# EasyEDA Pro project ProPrj_PCB_PCB_PCB_PCB_STM32F103C8T6(gift)_2023-09-09_2023-10-22_2024-01-15_2025-05-13.epro, board PCB1
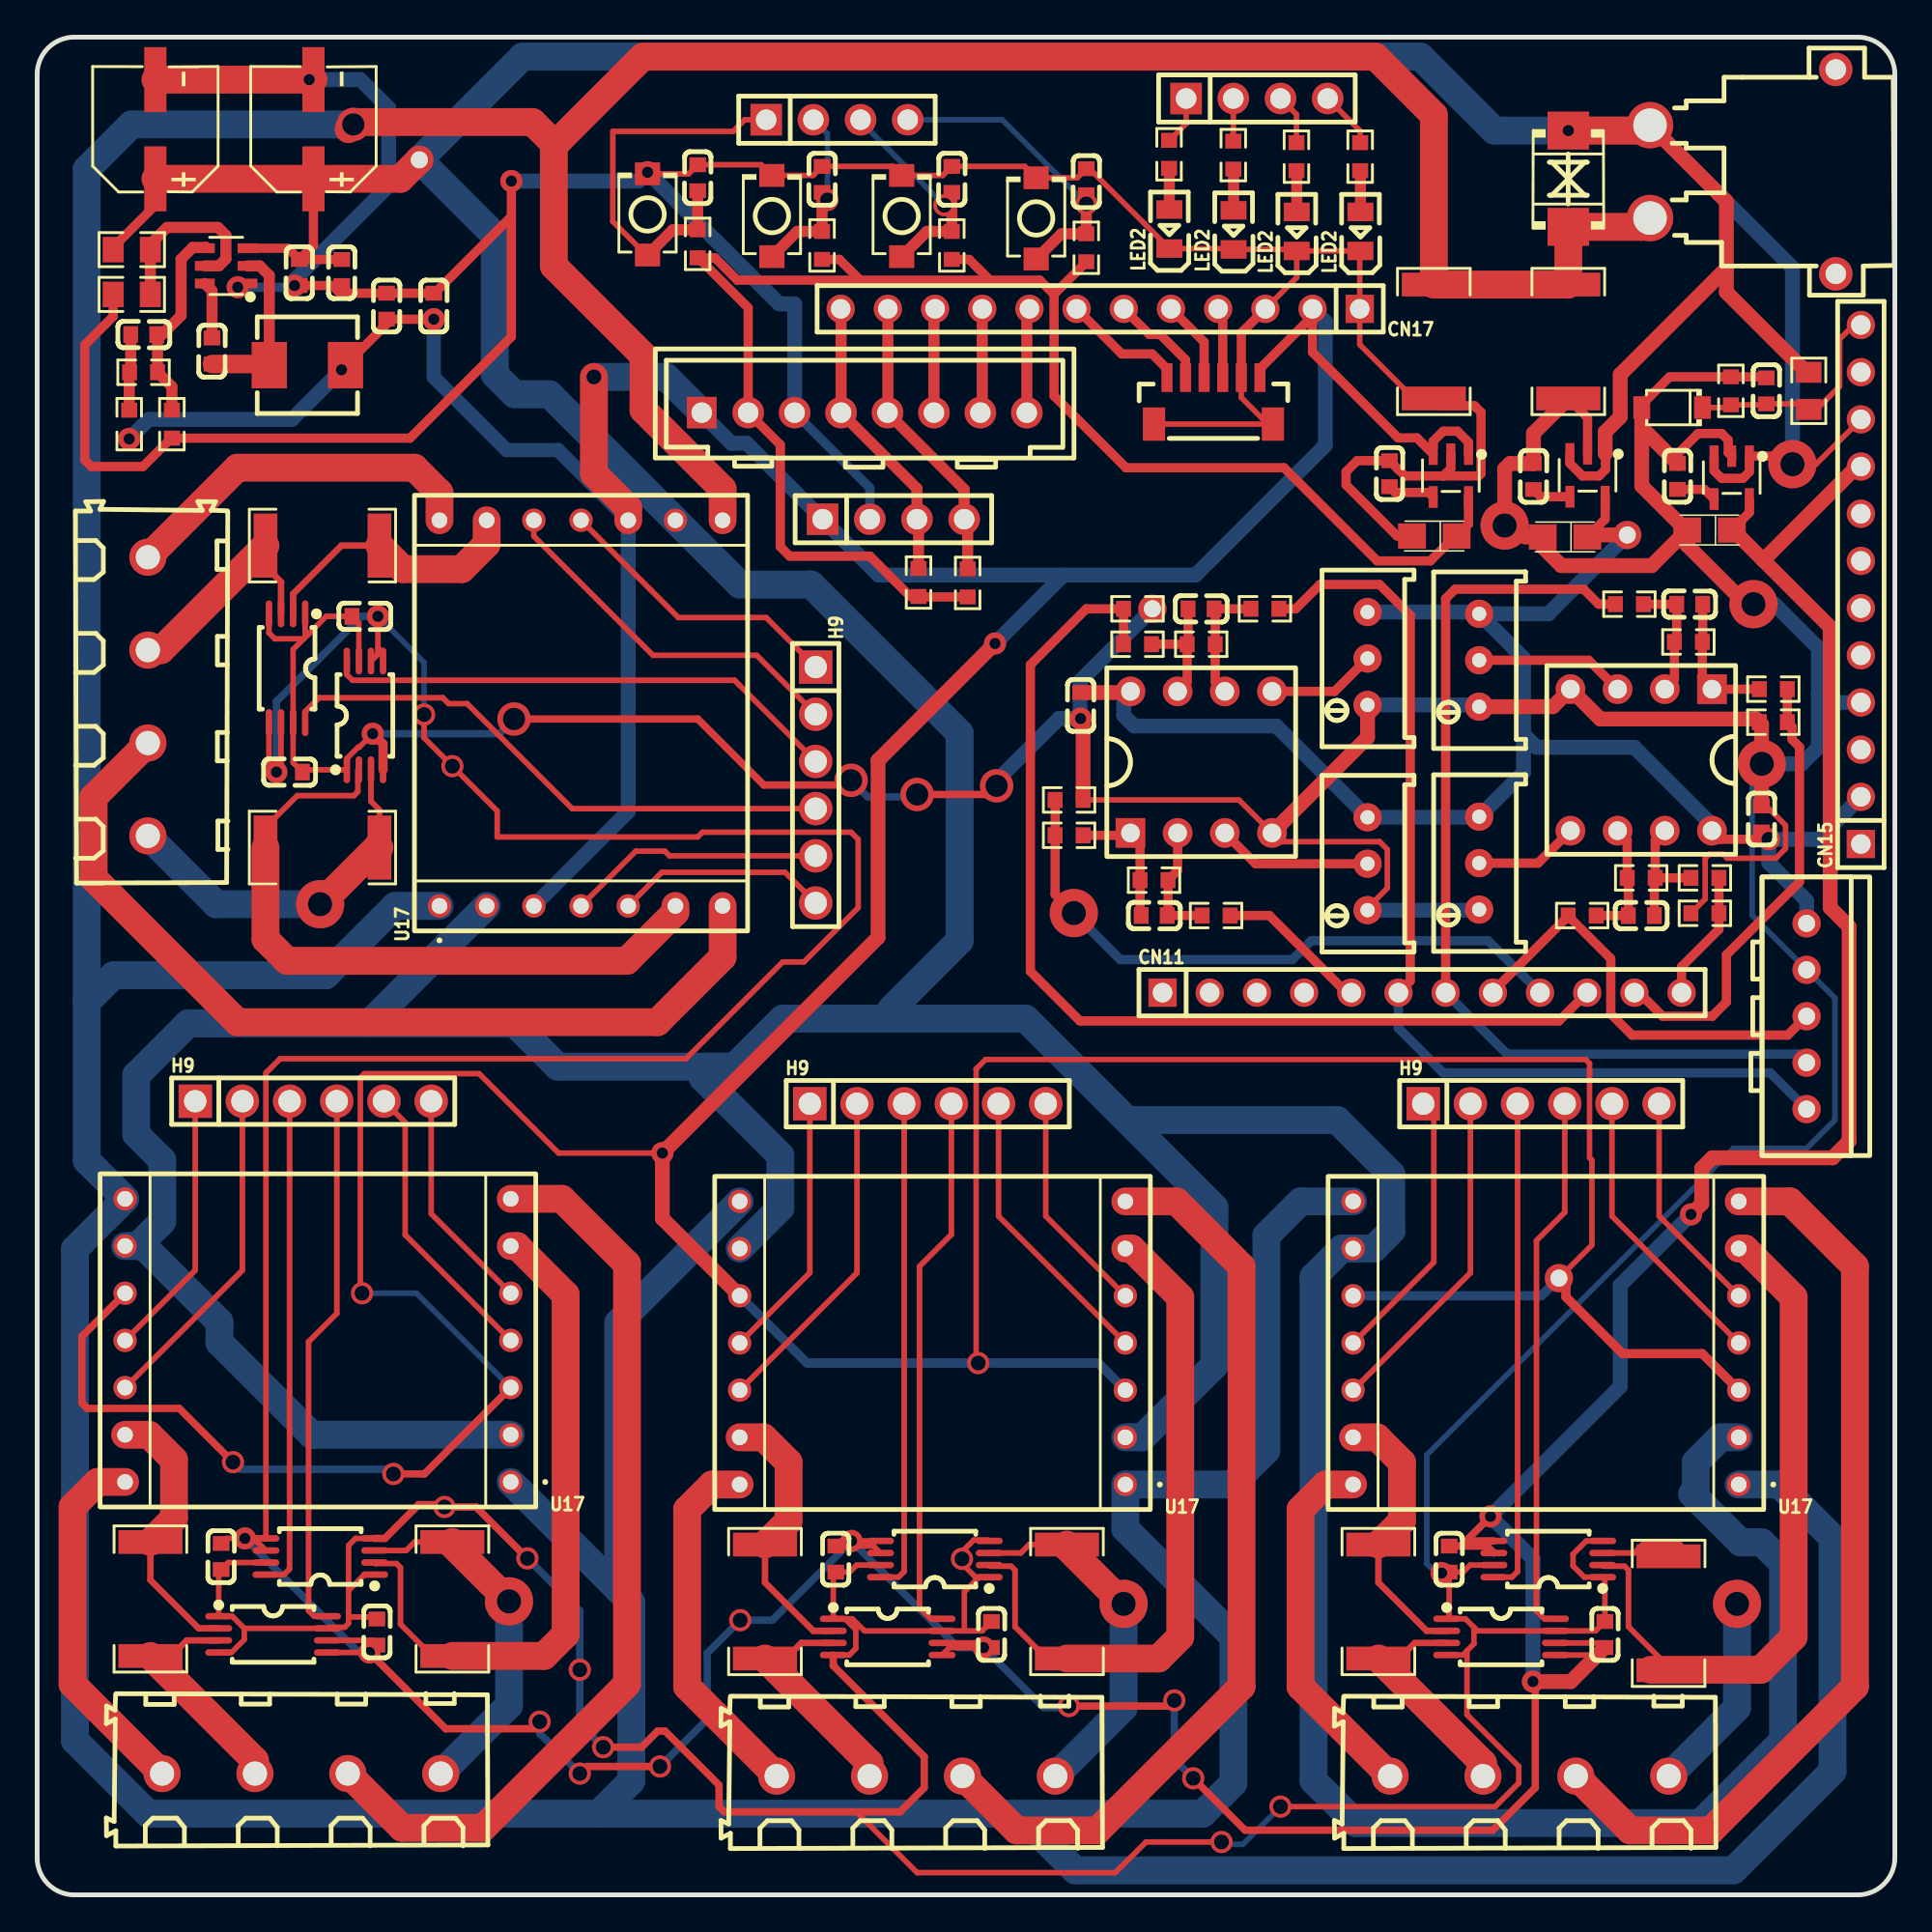
[diagram p10: board, top side]
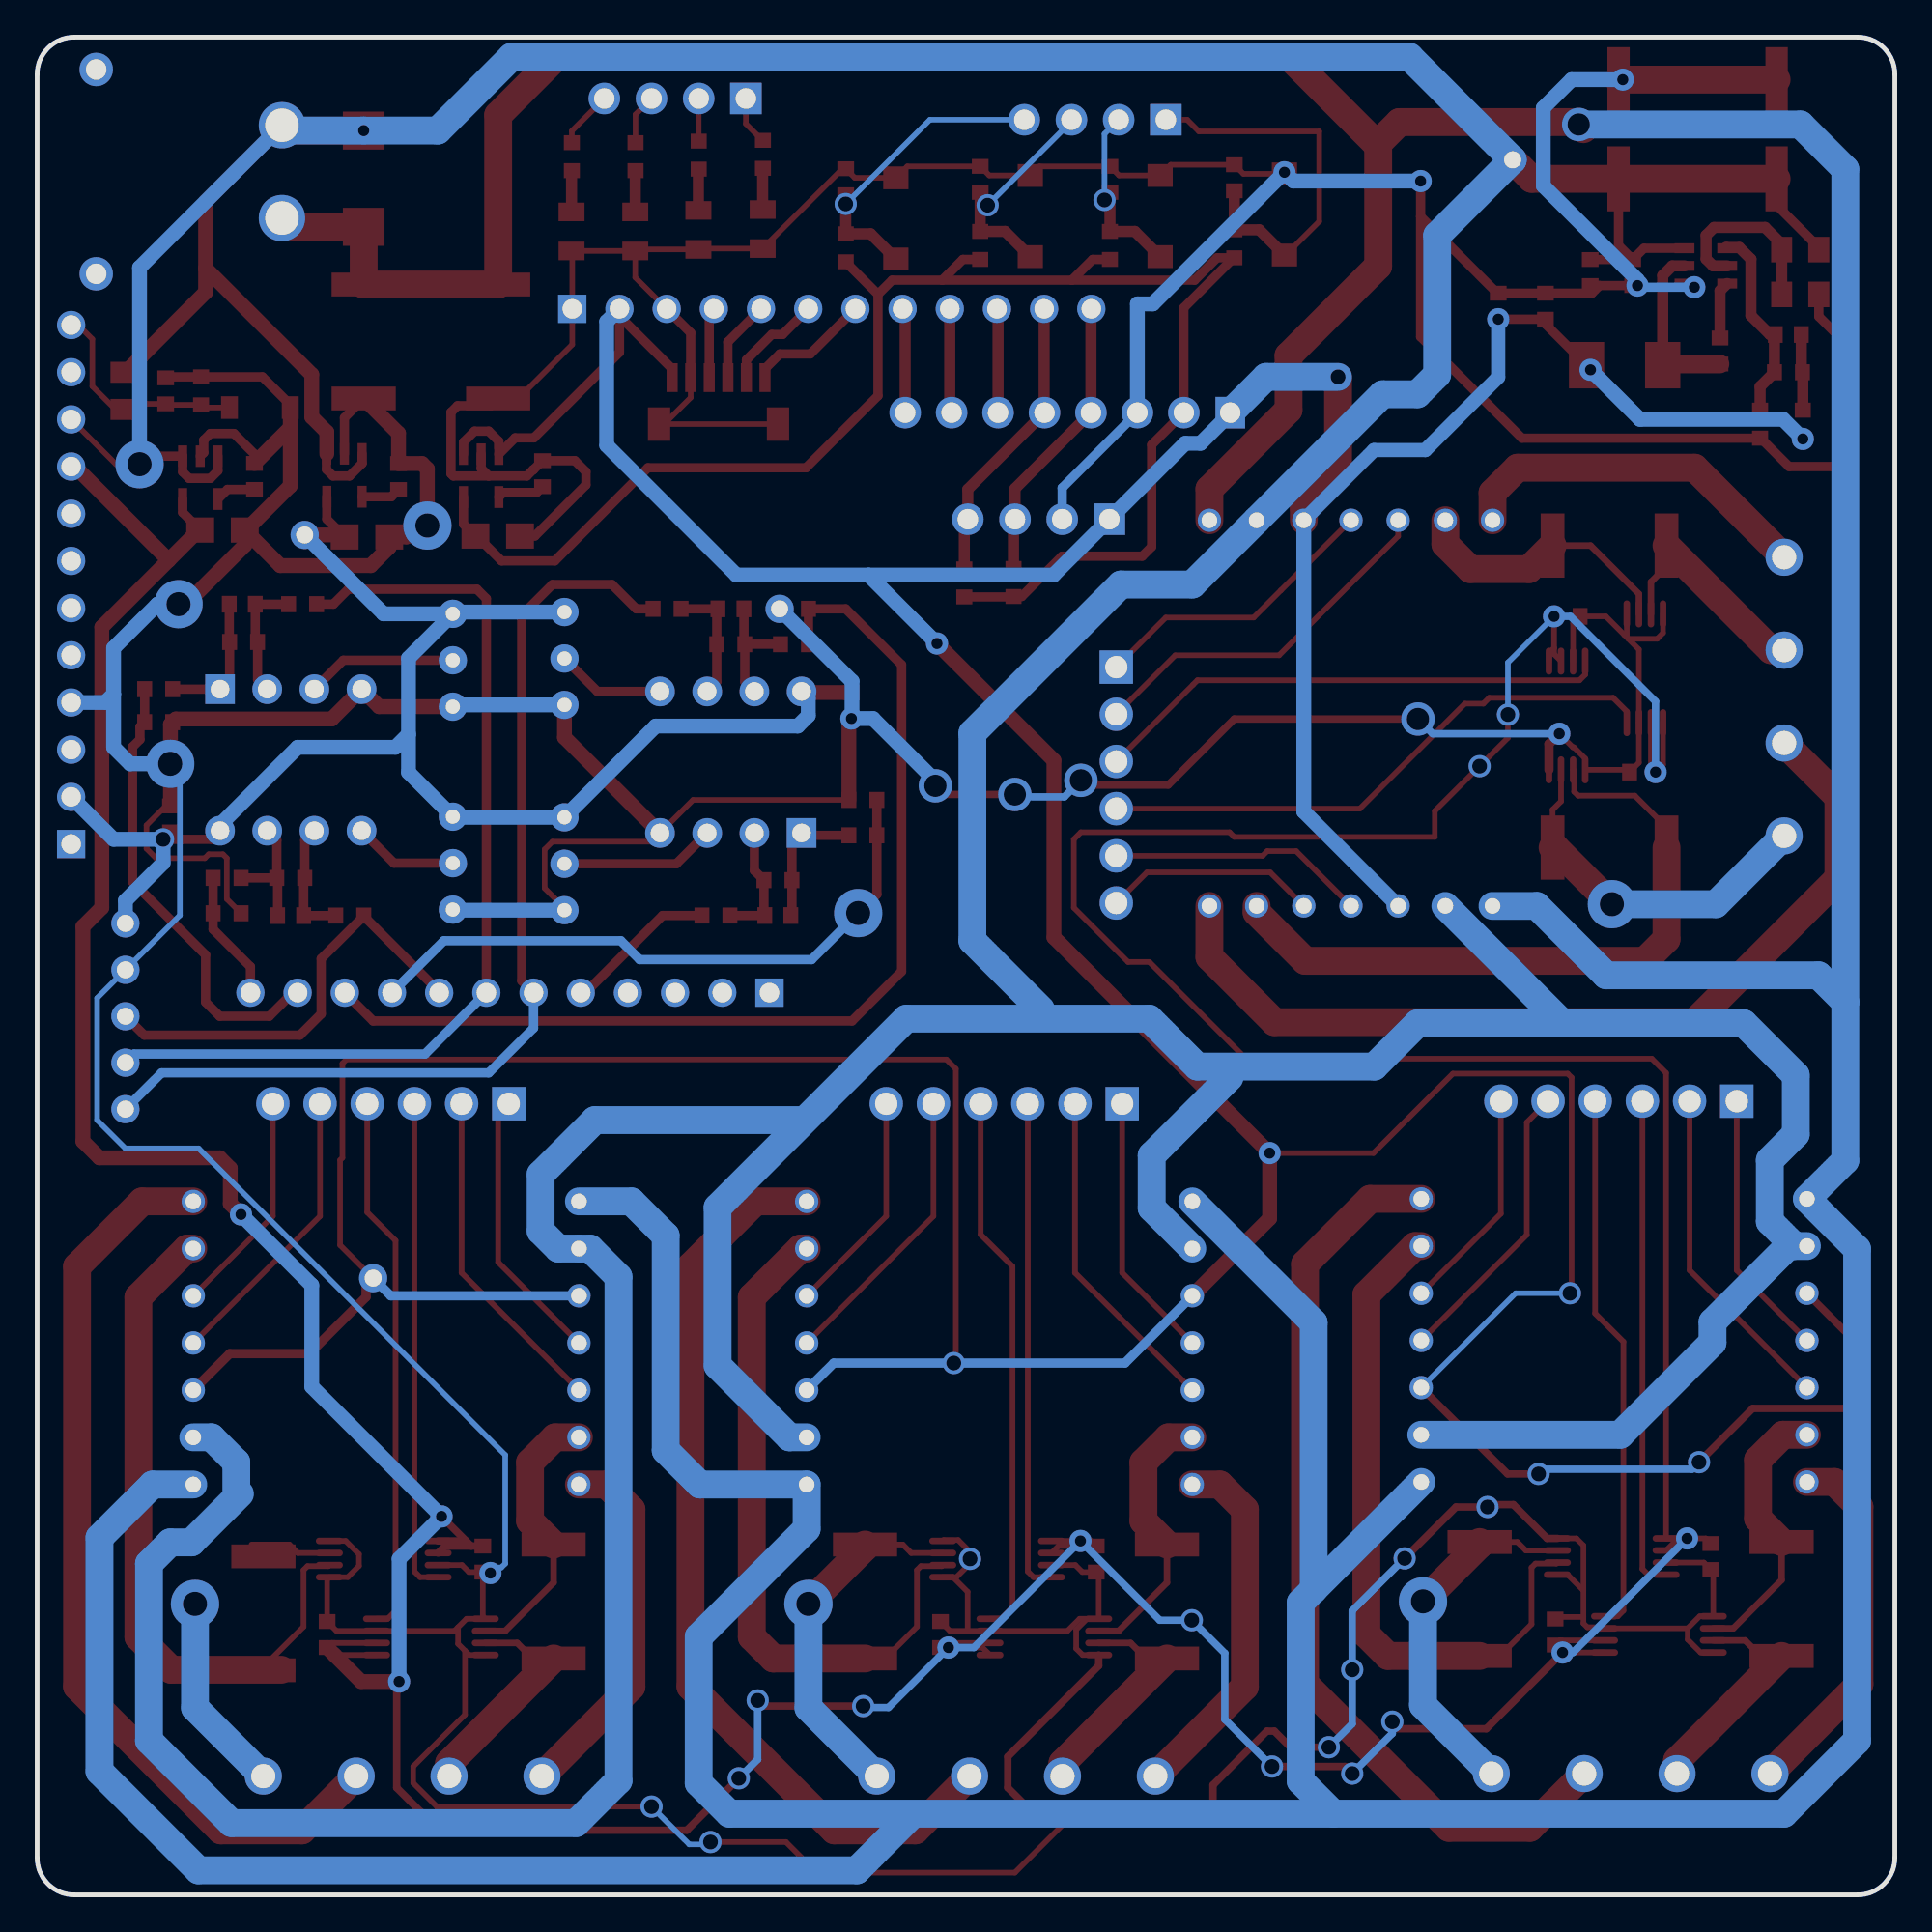
[diagram p11: board, bottom side, seen from below]

Outline 100 x 100 mm; copper layers: Top Layer, Bottom Layer. Coordinates in mm from the lower left corner of the outline.
Outline path: 0,98 0,2 arc(0.59,0.59) 2,0 98,0 arc(99.41,0.59) 100,2 100,98 arc(99.41,99.41) 98,100 2,100 arc(0.59,99.41) 0,98
Stack: Top Layer 0.035mm / Dielectric1 1.51mm FR4 er 4.5 / Bottom Layer 0.035mm

## Design rules (mm)
template: JLCPCB Capability(Two Layers Board)
spacing copperThickness1oz (default): track to track 0.102, other pairs 0.152 to 0.3
spacing copperThickness2oz: track to track 0.203, other pairs 0.152 to 0.3
track width copperThickness1oz (default): min 0.127, default 0.254, max 2.54
track width copperThickness2oz: min 0.203, default 0.254, max 2.54
differential pair differentialPair (default): width min 0.127, default 0.254, max 2.54; gap min 0.152, default 0.152
via viaSize (default): diameter min 0.5, default 0.61, max 10; hole min 0.3, default 0.305, max 6.3

## Placement (name value [footprint] x y rotation side)
C1  47uF  [CAP-SMD_BD6.3-L6.6-W6.6-LS7.6-FD]  6.36 95.04 90 top
C2  47uF  [CAP-SMD_BD6.3-L6.6-W6.6-LS7.6-FD]  14.87 95.04 90 top
C3  10uF  [C0603]  16.4 87.33 90 top
C4  100nF  [C0603]  14.11 87.33 90 top
C5  100nF  [C0603]  9.41 83.1 90 top
C6  22uF  [C0603]  18.81 85.52 270 top
C7  22uF  [C0603]  21.35 85.52 270 top
C8  75pF  [C0603]  5.73 83.99 180 top
C9  1uF  [CASE-A_3216]  82.25 73.1 180 top
C10  100nF  [C0603]  80.55 76.35 270 top
C11  1uF  [CASE-A_3216]  90.02 73.47 180 top
C12  100nF  [C0603]  88.3 76.35 270 top
C17  100nF  [C0603]  92.82 57.92 90 top
C18  33pF  [C0603]  88.96 69.48 0 top
C19  33pF  [C0603]  86.35 52.71 0 top
C20  100nF  [C0603]  56.17 64.02 270 top
C21  33pF  [C0603]  60.13 52.72 180 top
C22  33pF  [C0603]  62.65 69.23 180 top
C23  1uF  [CASE-A_3216]  75.21 73.15 180 top
C24  100nF  [C0603]  72.8 76.5 270 top
C40  100nF  [C0603]  42.25 92.34 270 top
C40#2  -  [C0603]  49.24 92.34 270 top
C40#3  -  [C0603]  56.47 92.22 270 top
C40#4  -  [C0603]  35.56 92.43 270 top
C43  100nF  [C0603]  93.08 80.96 270 top
C45  100nF  [C0603]  51.37 14.01 270 top
C45#2  -  [C0603]  84.39 14.01 270 top
C45#3  -  [C0603]  13.58 60.44 180 top
C45#4  -  [C0603]  18.29 14.15 270 top
C46  100nF  [C0603]  9.91 18.21 90 top
C46#2  -  [C0603]  42.99 18.08 90 top
C46#3  -  [C0603]  76.01 18.08 90 top
C46#4  -  [C0603]  17.64 68.82 0 top
CN1  XT30PW-M  [CONN-TH_XT30PW-M]  91.82 92.76 90 top
CN3  TOF  [CONN-SMD_A1002WV-S-6P]  63.32 80.42 0 top
CN4  HALL_IN  [CONN-TH_5P-P2.50_HC-XHB-5A]  95.25 47.3 270 top
CN7  WJ127-5.0-4P  [CONN-TH_4P-P5.00_WJ127-5.0-4P]  47.31 6.39 0 top
CN7#2  -  [CONN-TH_4P-P5.00_WJ127-5.0-4P]  80.33 6.39 0 top
CN7#3  -  [CONN-TH_4P-P5.00_WJ127-5.0-4P]  5.96 64.5 270 top
CN7#4  -  [CONN-TH_4P-P5.00_WJ127-5.0-4P]  14.22 6.53 0 top
CN9  UI  [CONN-TH_8P-P2.50_HCTL_HC-XHB-8A]  44.52 79.79 0 top
CN11  HB-PH3-254112PB2GOP  [HDR-TH_12P-P2.54-V-M]  74.55 48.56 0 top
CN15  HB-PH3-254112PB2GOP  [HDR-TH_12P-P2.54-V-M]  98.17 70.54 90 top
CN17  HB-PH3-254112PB2GOP  [HDR-TH_12P-P2.54-V-M]  57.22 85.38 180 top
D1  TVS  [SMB_L4.6-W3.6-LS5.4-BI]  82.42 92.38 270 top
D2  BZT52C3V3  [SOD-123_L2.7-W1.6-LS3.7-RD]  88.01 80.06 180 top
H8  MF254V-11-04-1000-H70  [HDR-TH_4P-P2.54-V-F-3]  43.05 95.55 0 top
H8#2  -  [HDR-TH_4P-P2.54-V-F-3]  46.09 74.05 0 top
H8#3  -  [HDR-TH_4P-P2.54-V-F-3]  65.66 96.7 0 top
H9  2.54-1x6P直针  [HDR-TH_6P-P2.54-V-M-1]  47.94 42.59 0 top
H9#2  -  [HDR-TH_6P-P2.54-V-M-1]  80.96 42.59 0 top
H9#3  -  [HDR-TH_6P-P2.54-V-M-1]  41.91 59.74 270 top
H9#4  -  [HDR-TH_6P-P2.54-V-M-1]  14.86 42.72 0 top
L1  10uH  [IND-SMD_L5.4-W5.2_FXL0530]  14.55 82.34 0 top
LED2  NCD0805G1  [LED0805-R-RD]  64.41 89.63 90 top
LED2#2  -  [LED0805-R-RD]  67.8 89.54 90 top
LED2#3  -  [LED0805-R-RD]  71.23 89.54 90 top
LED2#4  -  [LED0805-R-RD]  60.95 89.67 90 top
NOREF  -  [Pad_e4911]  20.57 93.4 0 top
NOREF#2  -  [Pad_e4283]  85.6 73.2 0 top
NOREF#3  -  [Pad_e5825]  81.91 33.2 0 top
NOREF#4  -  [Pad_e5766]  60.03 69.23 0 top
R1  511kΩ  [R0805]  5.09 88.56 180 top
R2  105kΩ  [R0805]  5.09 86.15 0 top
R3  49R9  [R0603]  4.95 79.17 270 top
R4  100K  [R0603]  5.73 81.96 180 top
R5  13K3  [R0603]  7.25 79.17 90 top
R6  4.7K  [R0603]  47.44 70.64 270 top
R7  4.7K  [R0603]  50.09 70.62 270 top
R8  0Ω  [R2512]  75.18 83.62 270 top
R9  0Ω  [R2512]  82.42 83.62 270 top
R14  10kΩ  [RES-ADJ-TH_3P-L10.0-W10.0-P2.50-L]  77.62 55.54 90 top
R15  4.7K  [R0603]  85.71 69.48 0 top
R16  100K  [R0603]  88.89 67.44 0 top
R17  4.7K  [R0603]  93.46 64.9 180 top
R18  15K  [R0603]  93.46 63.13 0 top
R19  10kΩ  [RES-ADJ-TH_3P-L10.0-W10.0-P2.50-L]  77.62 66.46 90 top
R20  4.7K  [R0603]  83.17 52.71 0 top
R21  100K  [R0603]  86.35 54.74 0 top
R22  4.7K  [R0603]  89.78 54.74 180 top
R23  15K  [R0603]  89.78 52.84 0 top
R24  10kΩ  [RES-ADJ-TH_3P-L10.0-W10.0-P2.50-L]  71.61 66.55 90 top
R25  4.7K  [R0603]  63.46 52.72 180 top
R26  100K  [R0603]  60.12 54.62 180 top
R27  4.7K  [R0603]  55.55 57.03 0 top
R28  15K  [R0603]  55.55 58.94 180 top
R29  10kΩ  [RES-ADJ-TH_3P-L10.0-W10.0-P2.50-L]  71.61 55.51 90 top
R30  4.7K  [R0603]  66.09 69.23 180 top
R31  100K  [R0603]  62.66 67.32 180 top
R32  4.7K  [R0603]  59.23 67.32 0 top
R33  15K  [R0603]  59.23 69.23 180 top
R35  1K  [R0603]  64.39 93.65 270 top
R35#2  -  [R0603]  67.79 93.57 270 top
R35#3  -  [R0603]  71.22 93.57 270 top
R35#4  -  [R0603]  60.93 93.69 270 top
R37  10K  [R0603]  35.56 88.88 90 top
R37#2  -  [R0603]  42.25 88.79 90 top
R37#3  -  [R0603]  49.24 88.79 90 top
R37#4  -  [R0603]  56.47 88.66 90 top
R40  100kΩ  [R0805]  95.37 80.96 90 top
R41  10kΩ  [R0603]  91.18 80.96 270 top
R43  5mΩ  [R2512]  39.18 15.79 90 top
R43#2  -  [R2512]  72.2 15.79 90 top
R43#3  -  [R2512]  15.36 72.63 0 top
R43#4  -  [R2512]  6.1 15.93 90 top
R44  5mΩ  [R2512]  22.35 15.93 270 top
R44#2  -  [R2512]  55.44 15.79 270 top
R44#3  -  [R2512]  87.82 15.16 270 top
R44#4  -  [R2512]  15.36 56.38 180 top
SW1  RESET  [SW-SMD_L3.9-W3.0-P4.45]  32.86 90.46 90 top
SW1#2  -  [SW-SMD_L3.9-W3.0-P4.45]  39.55 90.37 90 top
SW1#3  -  [SW-SMD_L3.9-W3.0-P4.45]  46.54 90.37 90 top
SW1#4  -  [SW-SMD_L3.9-W3.0-P4.45]  53.78 90.24 90 top
U3  TPS54302DDCR  [SOT-23-6_L2.9-W1.6-P0.95-LS2.8-BL]  10.17 87.69 90 top
U5  SPX3819-5  [SOT-23-5_L3.0-W1.7-P0.95-LS2.8-BL]  83.46 76.41 180 top
U6  SPX3819-3V3  [SOT-23-5_L3.0-W1.7-P0.95-LS2.8-BL]  91.22 76.29 180 top
U11  -  [DIP-8_L10.2-W10.2-P2.54-LS7.6-BL]  86.35 61.09 180 top
U12  -  [DIP-8_L10.2-W10.2-P2.54-LS7.6-BL]  62.66 60.97 0 top
U13  SPX3819-3V3  [SOT-23-5_L3.0-W1.7-P0.95-LS2.8-BL]  76.1 76.4 180 top
U17  AT8236  [AT8236-Dual-Module]  15.11 29.9 180 top
U17#2  -  [AT8236-Dual-Module]  48.2 29.76 180 top
U17#3  -  [AT8236-Dual-Module]  81.22 29.76 180 top
U17#4  -  [AT8236-Dual-Module]  29.33 63.61 90 top
U20  INA240A2  [TSSOP-8_L4.4-W3.0-P0.65-LS6.4-BL]  45.78 13.88 270 top
U20#2  -  [TSSOP-8_L4.4-W3.0-P0.65-LS6.4-BL]  78.8 13.88 270 top
U20#3  -  [TSSOP-8_L4.4-W3.0-P0.65-LS6.4-BL]  13.45 66.03 180 top
U20#4  -  [TSSOP-8_L4.4-W3.0-P0.65-LS6.4-BL]  12.7 14.02 270 top
U21  INA240A2  [TSSOP-8_L4.4-W3.0-P0.65-LS6.4-BL]  48.32 18.08 90 top
U21#2  -  [TSSOP-8_L4.4-W3.0-P0.65-LS6.4-BL]  81.34 18.08 90 top
U21#3  -  [TSSOP-8_L4.4-W3.0-P0.65-LS6.4-BL]  17.64 63.49 0 top
U21#4  -  [TSSOP-8_L4.4-W3.0-P0.65-LS6.4-BL]  15.24 18.21 90 top

## Footprints (pads in the part's own frame, mm; a bottom-side part is the same pattern mirrored in y, then rotated)
AT8236-Dual-Module
  round 1.26 hole 0.84: 1(-10.38,7.671) 2(-10.38,5.131) 3(-10.38,2.591) 4(-10.38,0.051) 5(-10.38,-2.489) 6(-10.38,-5.029) 7(-10.38,-7.569) 8(10.38,7.671) 9(10.38,5.131) 10(10.38,2.591) 11(10.38,0.051) 12(10.38,-2.489) 13(10.38,-5.029) 14(10.38,-7.569)
C0603
  rect 0.8x0.9 smd: 1(-0.7,0) 2(0.7,0)
CAP-SMD_BD6.3-L6.6-W6.6-LS7.6-FD
  rect 3.5x1.2 smd: 1(-2.67,0) 2(2.67,0)
CASE-A_3216
  rect 1.5x1.359 smd: 1(-1.2,0) 2(1.2,0)
CONN-SMD_A1002WV-S-6P
  rect 0.6x1.55 smd: 1(2.499,1.251) 2(1.499,1.251) 3(0.501,1.25) 4(-0.501,1.251) 5(-1.501,1.251) 6(-2.501,1.251)
  rect 1.2x1.8 smd: 7(3.201,-1.251) 8(-3.201,-1.251)
CONN-TH_4P-P5.00_WJ127-5.0-4P
  round 2 hole 1.3: 1(-7.5,0) 2(-2.5,0) 3(2.5,0) 4(7.5,0)
CONN-TH_5P-P2.50_HC-XHB-5A
  round 1.524 hole 0.914: 1(-5,0) 2(-2.5,0) 3(0,0) 4(2.5,0) 5(5,0)
CONN-TH_8P-P2.50_HCTL_HC-XHB-8A
  rect 1.6x1.7 hole 1.1: 1(-8.75,0)
  round 1.7 hole 1.1: 2(-6.25,0) 3(-3.75,0) 4(-1.25,0) 5(1.25,0) 6(3.75,0) 7(6.25,0) 8(8.75,0)
CONN-TH_XT30PW-M
  round 2.5 hole 1.8: 1(-2.5,5) 2(2.5,5)
  round 1.8 hole 1.1: 3(5.5,-5) 4(-5.5,-5)
DIP-8_L10.2-W10.2-P2.54-LS7.6-BL
  rect 1.6x1.6 hole 1: 1(-3.808,-3.81)
  round 1.6 hole 1: 2(-1.27,-3.81) 3(1.27,-3.81) 4(3.81,-3.81) 5(3.81,3.81) 6(1.27,3.81) 7(-1.27,3.81) 8(-3.81,3.81)
HDR-TH_4P-P2.54-V-F-3
  rect 1.7x1.7 hole 1.1: 1(-3.81,0)
  round 1.7 hole 1.1: 2(-1.27,0) 3(1.27,0) 4(3.81,0)
HDR-TH_6P-P2.54-V-M-1
  rect 1.8x1.8 hole 1.2: 1(-6.35,0)
  round 1.8 hole 1.2: 2(-3.81,0) 3(-1.27,0) 4(1.27,0) 5(3.81,0) 6(6.35,0)
HDR-TH_12P-P2.54-V-M
  rect 1.524x1.524 hole 1.05: 1(-13.97,0)
  round 1.524 hole 1.05: 2(-11.43,0) 3(-8.89,0) 4(-6.35,0) 5(-3.81,0) 6(-1.27,0) 7(1.27,0) 8(3.81,0) 9(6.35,0) 10(8.89,0) 11(11.43,0) 12(13.97,0)
IND-SMD_L5.4-W5.2_FXL0530
  rect 1.9x2.5 smd: 1(-2.05,0) 2(2.05,0)
LED0805-R-RD
  rect 1x1.399 smd: 1(1.05,0) 2(-1.05,0)
Pad_e4283
  round 1.524 hole 0.914: 1(0,0)
Pad_e4911
  round 1.524 hole 0.914: 1(0,0)
Pad_e5766
  round 1.524 hole 0.914: 1(0,0)
Pad_e5825
  round 1.524 hole 0.914: 1(0,0)
R0603
  rect 0.806x0.864 smd: 1(-0.753,0) 2(0.753,0)
R0805
  rect 1.133x1.377 smd: 1(-1,0) 2(1,0)
R2512
  rect 1.282x3.456 smd: 1(-3.067,0) 2(3.067,0)
RES-ADJ-TH_3P-L10.0-W10.0-P2.50-L
  round 1.524 hole 0.762: 1(-2.5,0) 2(0,0) 3(2.5,0)
SMB_L4.6-W3.6-LS5.4-BI
  rect 2.047x2.241 smd: 1(-2.591,0) 2(2.591,0)
SOD-123_L2.7-W1.6-LS3.7-RD
  rect 0.91x1.22 smd: 1(-1.635,0) 2(1.635,0)
SOT-23-5_L3.0-W1.7-P0.95-LS2.8-BL
  rect 0.49x1.157 smd: 1(-0.95,-1.153) 2(0,-1.153) 3(0.95,-1.153)
  rect 0.49x1.175 smd: 4(0.95,1.153) 5(-0.95,1.153)
SOT-23-6_L2.9-W1.6-P0.95-LS2.8-BL
  rect 0.532x1.072 smd: 1(-0.95,-1.149) 2(0,-1.149) 3(0.95,-1.149) 4(0.95,1.149) 5(0,1.149) 6(-0.95,1.149)
SW-SMD_L3.9-W3.0-P4.45
  rect 1.23x1.36 smd: 1(-2.185,0) 2(2.185,0)
TSSOP-8_L4.4-W3.0-P0.65-LS6.4-BL
  oval 0.353x1.454 smd: 1(-0.975,-2.927) 2(-0.325,-2.927) 3(0.325,-2.927) 4(0.975,-2.927) 5(0.975,2.927) 6(0.325,2.927) 7(-0.325,2.927) 8(-0.975,2.927)

## Nets
3V3: C23.1 CN9.2 R6.2 R7.2 R37.1 R37#2.1 R37#3.1 R37#4.1 U13.5
+5V: C6.2 C7.2 CN3.1 CN9.1 CN17.2 H8#2.1 L1.2 NOREF#3.1 R3.2 U13.1 U13.3 U17.3 U17.12 U17#2.3 U17#2.12 U17#3.3 U17#3.12 U17#4.3 U17#4.12
A3V3: C11.1 C45.2 C45#2.2 C45#3.2 C45#4.2 C46.2 C46#2.2 C46#3.2 C46#4.2 CN15.9 U6.5 U20.5 U20.6 U20#2.5 U20#2.6 U20#3.5 U20#3.6 U20#4.5 U20#4.6 U21.5 U21.6 U21#2.5 U21#2.6 U21#3.5 U21#3.6 U21#4.5 U21#4.6
AGND: C9.2 C10.1 C11.2 C12.1 C17.2 C20.2 C43.1 C45.1 C45#2.1 C45#3.1 C45#4.1 C46.1 C46#2.1 C46#3.1 C46#4.1 CN4.2 CN15.4 D2.2 NOREF#4.1 R9.2 R14.1 R18.1 R19.1 R23.1 R24.1 R28.1 R29.1 R33.1 R41.1 U5.2 U6.2 U11.4 U12.4 U20.1 U20.4 U20.7 U20#2.1 U20#2.4 U20#2.7 U20#3.1 U20#3.4 U20#3.7 U20#4.1 U20#4.4 U20#4.7 U21.1 U21.4 U21.7 U21#2.1 U21#2.4 U21#2.7 U21#3.1 U21#3.4 U21#3.7 U21#4.1 U21#4.4 U21#4.7
GND: C1.2 C2.2 C3.1 C4.1 C6.1 C7.1 C23.2 C24.1 C40.1 C40#2.1 C40#3.1 C40#4.1 CN3.2 CN3.7 CN3.8 CN9.3 CN17.1 CN17.3 H8#2.2 LED2.2 LED2#2.2 LED2#3.2 LED2#4.2 R2.1 R5.1 R8.2 SW1.2 SW1#2.2 SW1#3.2 SW1#4.2 U3.1 U13.2
PGND: CN1.1 CN1.3 CN1.4 D1.2 R8.1 R9.1 U17.1 U17.14 U17#2.1 U17#2.14 U17#3.1 U17#3.14 U17#4.1 U17#4.14
VCC: C1.1 C2.1 C3.2 C4.2 CN1.2 D1.1 NOREF.1 R1.2 R40.2 U3.3 U5.1 U5.3 U6.1 U6.3 U17.2 U17.13 U17#2.2 U17#2.13 U17#3.2 U17#3.13 U17#4.2 U17#4.13
A+5V: C9.1 C17.1 C20.1 CN4.1 CN15.2 NOREF#2.1 R14.3 R19.3 R24.3 R29.3 U5.5 U11.8 U12.8
ADC1_IN8: H9.4 H9#2.4 H9#3.4 H9#4.4 U20.8 U20#2.8 U20#3.8 U20#4.8
ADC1_IN9: H9.3 H9#2.3 H9#3.3 H9#4.3 U21.8 U21#2.8 U21#3.8 U21#4.8
ADC_IN15: C43.2 CN15.12 D2.1 R40.1 R41.2
ADC_IN_HALL_1: CN11.12 R22.1 R23.2
ADC_IN_HALL_2: CN11.11 R17.1 R18.2
ADC_IN_HALL_3: CN11.10 R32.1 R33.2
ADC_IN_HALL_4: CN11.9 R27.1 R28.2
ALT_1_A: CN7.1 CN7#2.1 CN7#3.1 CN7#4.1 U17.8 U17#2.8 U17#3.8 U17#4.8
ALT_1_B: CN7.2 CN7#2.2 CN7#3.2 CN7#4.2 R43.1 R43#2.1 R43#3.1 R43#4.1 U20.3 U20#2.3 U20#3.3 U20#4.3
ALT_1_B_CS: R43.2 R43#2.2 R43#3.2 R43#4.2 U17.9 U17#2.9 U17#3.9 U17#4.9 U20.2 U20#2.2 U20#3.2 U20#4.2
ALT_2_A: CN7.3 CN7#2.3 CN7#3.3 CN7#4.3 U17.7 U17#2.7 U17#3.7 U17#4.7
ALT_2_B: CN7.4 CN7#2.4 CN7#3.4 CN7#4.4 R44.1 R44#2.1 R44#3.1 R44#4.1 U21.3 U21#2.3 U21#3.3 U21#4.3
ALT_2_B_CS: R44.2 R44#2.2 R44#3.2 R44#4.2 U17.6 U17#2.6 U17#3.6 U17#4.6 U21.2 U21#2.2 U21#3.2 U21#4.2
ENC_A: CN9.7 CN17.9
ENC_B: CN9.8 CN17.8
ENC_KEY: CN9.6 CN17.10
HALL_IN1: CN4.3 CN11.8 R20.1
HALL_IN2: CN4.4 CN11.7 R15.1
HALL_IN3: CN4.5 CN11.6 R30.1
HALL_IN4: CN11.5 R25.1
I2C2_SCL: CN3.4 CN17.5
I2C2_SDA: CN3.3 CN17.4
NRST: C40.2 C40#2.2 C40#3.2 C40#4.2 H8.1 H8.2 H8.3 H8.4 R37.2 R37#2.2 R37#3.2 R37#4.2 SW1.1 SW1#2.1 SW1#3.1 SW1#4.1
OLED_SCL: CN9.4 CN17.12 H8#2.3 R6.1
OLED_SDA: CN9.5 CN17.11 H8#2.4 R7.1
PB14: H9.5 H9#2.5 H9#3.5 H9#4.5 U17.4 U17#2.4 U17#3.4 U17#4.4
PB15: H9.2 H9#2.2 H9#3.2 H9#4.2 U17.10 U17#2.10 U17#3.10 U17#4.10
PC7: H9.6 H9#2.6 H9#3.6 H9#4.6 U17.5 U17#2.5 U17#3.5 U17#4.5
PC8: H9.1 H9#2.1 H9#3.1 H9#4.1 U17.11 U17#2.11 U17#3.11 U17#4.11
PD0: H8#3.1 H8#3.2 H8#3.3 H8#3.4 R35.1 R35#2.1 R35#3.1 R35#4.1
PD8: CN3.5 CN17.6
PD9: CN3.6 CN17.7
TPS_EN: R1.1 R2.2 U3.5
TPS_SW: C5.1 L1.1 U3.2
$1N1133: C5.2 U3.6
$1N1138: C8.2 R3.1 R4.2
$1N7509: C10.2 U5.4
$1N7699: C12.2 U6.4
$1N22323: R19.2 U11.3
$1N22620: C18.2 R16.2 R17.2 U11.1
$1N22630: C18.1 R15.2 R16.1 U11.2
$1N29992: R14.2 U11.5
$1N30121: C19.1 R20.2 R21.1 U11.6
$1N30128: C19.2 R21.2 R22.2 U11.7
$1N30459: R29.2 U12.3
$1N30463: C21.2 R26.2 R27.2 U12.1
$1N30464: C21.1 R25.2 R26.1 U12.2
$1N30664: R24.2 U12.5
$1N30669: C22.1 R30.2 R31.1 U12.6
$1N30675: C22.2 R31.2 R32.2 U12.7
$1N32047: C24.2 U13.4
$1N44282: LED2.1 LED2#2.1 LED2#3.1 LED2#4.1 R35.2 R35#2.2 R35#3.2 R35#4.2
$1N45688: C8.1 R4.1 R5.2 U3.4
$1N84916: CN11.4
$1N84917: CN11.3
$1N84918: CN11.2
$1N84919: CN11.1
$1N85378: CN15.10
$1N85380: CN15.8
$1N85381: CN15.7
$1N85382: CN15.5
$1N85383: CN15.3
$1N85384: CN15.1
$1N85385: CN15.6
$1N85389: CN15.11

## Via types
v1: diameter 1.2, hole 0.6, Top Layer to Bottom Layer, 23 vias
v2: diameter 1.2, hole 0.8, Top Layer to Bottom Layer, 25 vias
v3: diameter 1.8, hole 1.2, Top Layer to Bottom Layer, 5 vias
v4: diameter 2.6, hole 1.3, Top Layer to Bottom Layer, 9 vias

## Routing (per net, layer and track width the routed paths; a pad name or vN(x,y) marks a point on that pad's centre or on a via; arc(x,y) is an arc through that point)
3V3: length 89.8
  Top Layer w0.5: R7.2 47.47,69.87 47.44,69.89 47,69.89 44.83,72.06 40.51,72.06 40,72.57 40,78.06 CN9.2 38.27,85.43 35.58,88.12 ; 35.58,88.12 36.49,88.12 37.69,86.92 44.3,86.92 ; 35.58,88.12 R37.1 ; 54.74,86.16 56.47,87.89 R37#4.1 ; 54.74,86.16 54.74,80.7 58.61,76.82 67.12,76.82 72.14,71.81 75,71.81 76.34,73.15 C23.1 77.05,73.79 U13.5 ; 54.74,86.16 53.97,86.92 51.28,86.92 ; R37#2.1 43.18,88.03 44.3,86.92 ; 51.28,86.92 50.17,88.03 R37#3.1 ; 51.28,86.92 44.3,86.92
+5V: length 370.9
  Top Layer w0.3: NOREF#3.1 83.69,34.98 83.69,39.55 83.57,39.67 83.57,44.75 83.35,44.97 51.05,44.97 50.55,44.46 50.55,28.74 v2(50.66,28.63) ; v1(33.66,39.93) 28.07,39.93 23.79,44.2 17.61,44.2 17.4,43.99 17.4,32.48 v2(17.49,32.39)
  Top Layer w0.4: U17.12 2.41,30.06 2.41,26.47 2.7,26.18 7.65,26.18 v2(10.54,23.29) ; v2(19.18,22.66) 20.84,22.66 U17.3
  Top Layer w0.5: NOREF#3.1 82.3,32.82 82.3,32.18 85.34,29.13 89.63,29.13 U17#3.3 ; 75.15,77.89 75.15,78.25 75.69,78.79 76.45,78.79 77.05,78.2 U13.1 ; L1.2 18.81,84.56 C6.2 v1(21.35,84.82) ; CN3.1 65.82,82.15 68.65,84.98 68.65,83.03 73.26,78.43 74.27,78.43 U13.3
  Top Layer w0.8: U17#2.12 33.66,36.41 v1(33.66,39.93) 45.27,51.54 45.27,61.07 v1(51.56,67.36)
  Top Layer w1.5: U17#4.12 31.82,74.66 29.97,76.5 v2(29.97,81.71)
  Bottom Layer w0.3: v2(17.49,32.39) 20.41,32.39 U17.3
  Bottom Layer w0.4: 19.05,22.91 10.92,22.91 v2(10.54,23.29)
  Bottom Layer w0.5: U17#3.12 80.97,32.25 NOREF#3.1 ; U17#2.3 57.12,28.63 v2(50.66,28.63) 41.44,28.63 U17#2.12
  Bottom Layer w0.762: v1(21.35,84.82) 21.35,81.7 25.27,77.78 28.04,77.78 U17#4.12
  Bottom Layer w0.8: v1(16.38,82.09) 13.72,79.43 6.01,79.43 v1(4.95,78.37) ; U17#4.12 31.82,58.31 U17#4.3 ; CN17.2 69.34,84.69 69.34,78.03 62.36,71.04 55.25,71.04 ; 55.25,71.04 v1(51.56,67.36) ; 55.25,71.04 45.29,71.04 H8#2.1 38.2,78.14 37.37,78.14 35.77,79.74 CN9.1
  Bottom Layer w1.5: CN9.1 33.85,81.71 v2(29.97,81.71)
A3V3: length 338.5
  Top Layer w0.3: 11.66,19.19 10.18,19.19 9.91,18.91 ; 11.66,19.19 U21#4.5 12.31,44.24 13.08,45.01 34.93,45.01 40.13,50.22 41.28,50.22 44.2,53.14 44.2,56.82 43.81,57.2 35.81,57.2 35.56,56.95 24.77,56.95 24.77,58.34 v2(22.35,60.76) 20.83,62.28 v2(20.83,63.54) ; 11.66,19.19 U21#4.6 ; U21.6 45.02,18.78 42.99,18.78 43.26,19.05 U21.5
  Top Layer w0.305: U20#3.6 13.13,60.69 v1(12.88,60.44) 12.48,60.84 U20#3.5 ; U20#2.6 84.14,13.56 C45#2.2 ; U20.5 49.11,13.31 C45.2 51.12,13.56 U20.6 ; 18.34,67.12 18.62,66.85 18.62,66.41 ; 18.34,67.12 18.34,66.79 U21#3.6 ; 18.34,67.12 v1(18.34,68.82) ; U20#4.5 v1(17.89,13.05) C45#4.2 18.04,13.7 U20#4.6 ; U20#2.5 83.99,12.91
  Top Layer w0.4: v2(62.23,6.27) 65.02,3.48 78.36,3.48 80.65,5.77 80.65,11.35 v1(80.52,11.48) ; U21#2.5 76.91,19.05 ; 76.91,19.05 v1(78.23,20.37) ; 76.91,19.05 76.64,18.78 ; v2(33.53,6.91) 29.59,6.91 v2(29.21,6.53) ; v2(61.21,10.47) 60.91,10.16 v2(55.54,10.16) ; 76.64,18.78 78.04,18.78 U21#2.6 ; 76.64,18.78 76.01,18.78 ; v1(17.89,13.05) 21.99,8.94 26.8,8.94
  Top Layer w0.5: U6.5 92.17,74.41 C11.1
  Top Layer w0.8: 92.92,71.84 91.29,73.47 C11.1 ; 92.92,71.84 97.96,76.89 CN15.9 ; 92.92,71.84 96.52,68.24 96.52,53.14 97.54,52.12 97.54,40.56 96.65,39.67 90.17,39.67 89.6,39.11 89.6,37.2 v1(89.03,36.63) ; C45#2.2 82.56,11.48 v1(80.52,11.48)
  Bottom Layer w0.3: v1(18.34,68.82) 20.83,66.34 v2(20.83,63.54)
  Bottom Layer w0.4: v2(61.21,10.47) 61.21,7.29 v2(62.23,6.27) ; v1(17.89,13.05) 17.33,13.05 v1(11.18,19.19) ; v2(33.53,6.91) 36.07,9.45 36.07,13 v2(37.85,14.78) 39.57,14.78 v1(43.84,19.05) 49.58,13.31 v1(50.95,13.31) 54.17,10.08 55.37,10.08 ; v2(29.21,6.53) 27.05,8.69 v2(27.05,9.32) ; v1(12.88,60.44) 12.88,64.24 17.46,68.82 v1(18.34,68.82)
  Bottom Layer w0.8: v1(89.03,36.63) 85.22,32.82 85.22,27.36 v1(78.23,20.37) 80.52,18.09 v1(80.52,11.48)
AGND: length 448.7
  Top Layer w0.3: 77.34,14.4 77.53,14.21 U20#2.7 83.89,14.21 C45#2.1 84.39,16.98 U21#2.1 83.28,17.1 82.68,17.7 82.68,18.34 83.39,19.05 U21#2.4 ; 77.34,14.4 76.88,14.86 U20#2.1 76.01,14.99 C46#3.1 76.76,17.38 77.13,17.75 U21#2.7 ; 77.34,14.4 77.34,13.51 76.97,13.14 ; 11.15,14.35 10.5,15 9.77,15 9.77,17.38 C46.1 10.28,17.89 U21#4.7 ; 11.15,14.35 11.15,13.74 10.45,13.05 U20#4.4 ; 11.15,14.35 U20#4.7 15.68,14.4 16.55,14.4 16.76,14.61 16.76,14.96 ; 94.11,56.71 94.11,56.32 93.6,55.8 90.98,55.8 90.76,56.02 90,56.02 89.79,55.8 89.79,53.61 R23.1 ; U20#3.4 12.48,67.93 12.79,67.61 14.35,67.61 ; 14.56,67.83 14.43,67.83 U20#3.1 ; 14.56,67.83 14.35,67.61 ; 14.56,67.83 15.56,68.82 C46#4.1 17.32,68.45 17.32,66.41 ; 16.76,16.38 16.76,14.96 ; 16.76,16.38 17.62,17.24 U21#4.1 ; 16.76,16.38 16.76,18.81 17.14,19.19 U21#4.4 ; 16.76,14.96 18.18,14.96 C45#4.1 ; 49.88,14.21 49.91,14.25 49.91,16.31 50.7,17.1 ; 49.88,14.21 50.87,14.21 C45.1 ; 49.88,14.21 U20.7 44.53,14.21 43.88,14.86 43.48,14.86 44.07,14.28 44.07,13.26 43.72,12.91 U20.4 ; 76.97,13.14 76.74,12.91 U20#2.4 ; 76.97,13.14 76.97,9.7 79.76,6.91 79.76,6.02 78.49,4.75 v2(66.93,4.75) ; U21.7 44.11,17.75 43.74,17.38 C46#2.1 42.86,17.24 U20.1 ; 94.11,56.93 94.11,57.58 93.07,58.62 C17.2 ; 50.7,17.1 50.51,17.1 49.78,17.83 49.78,18.47 50.42,19.1 51.2,19.1 U21.4 ; 50.7,17.1 U21.1 ; R29.1 71.61,53.12 72.68,54.19 72.68,56.28 72.26,56.69 66.94,56.69 U12.4 64.69,58.94 R28.1 ; v2(63.75,2.84) 59.69,2.84 58.04,1.19 47.37,1.19 44.1,4.47 ; 14.35,67.61 13.78,67.04 U20#3.7 13.78,60.94 C45#3.1 14.4,60.56 U21#3.1 16.67,61.17 17.27,61.77 17.33,61.77 v1(18.06,62.5)
  Top Layer w0.4: 26.54,17.96 23.62,20.88 v2(21.93,20.88) 21.8,21.01 20.54,21.01 18.72,19.19 U21#4.4 ; v2(30.47,7.95) 32.53,7.95 33.4,8.81 33.8,8.81 36.7,5.91 36.7,4.75 36.99,4.47 46.45,4.47 47.75,5.77 47.75,7.44 42.86,12.33 U20.4 ; 43.94,59.74 39.12,59.74 35.56,63.3 v3(25.67,63.3) ; v3(47.37,59.23) 51.18,59.23 51.82,59.87
  Top Layer w0.5: C12.1 88.3,77.56 89.41,78.66 90.68,78.66 91.03,78.31 91.03,77.63 U6.2 ; R9.2 83.46,79.52 U5.2 ; D2.2 86.38,80.22 87.87,81.71 R41.1 93.03,81.71 C43.1 ; v1(18.06,62.5) 18.62,61.95 18.62,60.56
  Top Layer w0.8: R28.1 56.3,63.19 v1(56.17,63.32) ; C12.1 86.38,78.98 ; 86.38,78.98 86.38,75.84 88.75,73.47 C11.2 ; 86.38,78.98 D2.2 ; R19.1 81.59,63.96 U11.4 84.14,63.3 92.53,63.3 R18.1 92.82,63.01 C17.2 ; C11.2 88.82,72.64 91.99,69.48 v4(92.39,69.48) ; C11.2 86.91,71.55 82.04,71.55 81.05,72.55 C9.2 80.12,73.1 78.99,74.22 78.99,76.76 79.28,77.05 C10.1 80.55,78.67 R9.2 ; U12.4 71.61,62.3 R24.1
  Bottom Layer w0.3: 75.82,17.32 75.52,17.62 75.01,17.62 74.8,17.83 74.8,23.68 91.31,40.18 95.25,40.18 96.77,41.71 96.77,48.27 CN4.2 92.32,52.73 92.32,60.36 v4(92.84,60.88) ; 63.88,2.72 64.9,2.72 v2(66.93,4.75)
  Bottom Layer w0.4: 46.48,59.11 44.7,59.11 v3(43.81,60) ; v2(30.47,7.95) 29.21,9.21 v2(29.21,12.12) 29.21,15.29 v2(26.39,18.11) ; v1(18.06,62.5) 24.88,62.5 v3(25.67,63.3)
  Bottom Layer w0.8: NOREF#4.1 56.13,65.33 56.13,63.32 ; R19.1 77.53,64.05 R24.1 ; 95.88,64.64 95.88,67.11 93.52,69.48 v4(92.39,69.48) ; 95.88,64.64 95.88,61.77 95,60.88 v4(92.84,60.88) ; 95.88,64.64 96.34,64.19 98.17,64.19 ; v1(56.17,63.32) 56.13,63.32 ; 56.13,63.32 55,63.32 51.42,59.74 ; R14.1 77.59,53.01 R29.1
  vias: v1(75.6,17.32) v2(49.78,18.09) v3(51.65,59.7) v4(78.99,73.71)
GND: length 207.7
  Top Layer w0.3: LED2#2.2 67.72,88.58 LED2.2 64.36,88.62 LED2#4.2 56.65,92.92 C40#3.1 55.99,92.43 SW1#4.2 53.16,93.04 C40#2.1 48.75,92.56 SW1#3.2 46.05,93.04 C40.1 41.76,92.56 SW1#2.2 38.98,93.13 C40#4.1 35.07,92.64 32.86,92.64 ; LED2#2.2 LED2#3.2 71.19,88.45 CN17.1 71.19,83.45 74.1,80.55 R8.2 ; LED2#2.2 67.8,87.07 CN17.3 ; 66.25,79.17 60.12,79.17 ; 66.25,79.17 66.52,79.17 ; 66.25,79.17 64.82,80.6 CN3.2
  Top Layer w0.5: R8.2 75.57,80.16 77.37,80.16 77.72,79.81 77.72,76.5 77.6,76.38 75.69,76.38 ; R2.1 4.09,84.96 2.57,83.44 2.57,77.24 2.92,76.89 5.7,76.89 7.22,78.41 R5.1 20.07,78.41 25.53,83.87 25.53,90.34 ; 75.69,76.38 76.1,76.79 U13.2 ; 75.69,76.38 73.64,76.38 73.3,76.71 73.29,76.71 C24.1 71.05,77.2 70.46,76.6 70.46,75.9 73.21,73.15 C23.2 ; 25.53,90.34 21.4,86.22 C7.1 C6.1 16.3,86.22 15.89,86.63 ; 25.53,90.34 v1(25.53,92.25) ; CN17.3 64.82,84.08 CN3.2 ; 15.89,86.63 C3.1 ; 15.89,86.63 C4.1
  Top Layer w1.5: C1.2 C2.2
  Bottom Layer w0.5: 13.76,86.54 v1(10.8,86.54) ; CN9.3 44.82,75.74 H8#2.2
  Bottom Layer w0.8: CN9.3 40.77,85.64 39.94,85.64 v1(32.86,92.73) 32.38,92.25 v1(25.53,92.25) ; v1(14.64,97.71) 17.4,97.71 18.92,96.19 18.92,92 13.86,86.93 v1(13.86,86.63)
PGND: length 452.3
  Top Layer w1.5: 27.69,94.41 26.67,95.43 17.14,95.43 16.76,95.05 ; U17#4.14 36.9,75.68 32.64,79.93 32.64,82.86 27.81,87.68 27.81,94.16 32.6,98.95 72.04,98.95 75.18,95.81 R8.1 R9.1 D1.2 86.35,89.79 CN1.1
  Bottom Layer w1.5: U17#2.14 31.29,30.8 31.29,16.43 ; 53.09,4.12 55.88,1.32 91.31,1.32 96.65,6.66 96.65,19.23 93.79,22.09 U17#3.1 ; v3(17.02,95.3) 5.08,95.3 2.67,92.89 2.67,48.06 ; U17#4.1 19.27,53.23 15.54,49.5 4.11,49.5 2.67,48.06 ; 30.23,4.37 5.97,4.37 2.03,8.31 2.03,34.76 U17.14 2.67,39.53 2.67,48.06 ; 30.23,4.37 31.98,6.13 31.98,15.73 31.29,16.43 ; 30.23,4.37 62.74,4.37 64.39,6.02 64.39,13.89 58.58,19.71 U17#2.1 64.33,22.09 66.17,23.93 66.17,35.48 68.01,37.33 U17#3.14 ; 31.29,16.43 U17.1
VCC: length 463.7
  Top Layer w0.5: C4.2 13.5,88.64 U3.3 ; C4.2 14.87,88.79 C2.1 ; C4.2 C3.2 ; U6.3 90.27,76.66 90.68,76.25 91.82,76.25 92.17,76.6 U6.1 94.06,77.44 94.49,77.01 ; U5.1 84.43,77.55 84.43,76.73 84.07,76.38 83.19,76.38 82.51,77.05 U5.3 ; R1.2 4.09,88.69 6.36,90.96 C1.1
  Top Layer w0.8: R40.2 95.24,81.96 90.93,86.27 90.93,87.55 ; CN1.2 90.93,91.15 90.93,87.55 ; 90.93,87.55 85.22,81.84 85.22,79.55 84.41,78.74 U5.1
  Top Layer w1.5: NOREF.1 19.55,92.37 C2.1 C1.1 ; CN1.2 86.53,94.97 v1(82.42,94.97)
  Bottom Layer w0.8: 94.49,77.01 94.49,87.59 CN1.2
  Bottom Layer w1.5: 17.88,46.91 25.69,46.91 28.02,44.58 37.55,44.58 40.13,47.17 53.21,47.17 63.37,37.01 63.37,28.5 59.5,24.63 U17#2.2 ; 17.88,46.91 8.13,46.91 5.33,44.12 5.33,40.94 6.73,39.55 6.73,36.25 5.57,35.08 ; 17.88,46.91 U17#4.2 ; 89.08,21.58 91.69,18.97 92.84,18.97 93.98,17.83 93.98,8.31 89.53,3.86 70.99,3.86 68.71,6.15 68.71,33.27 70.23,34.79 U17#3.13 71.95,34.79 72.9,35.74 72.9,38.79 69.98,41.71 59.06,41.71 ; U17#2.13 40,36.98 40,39.8 35.81,43.99 ; 89.28,21.78 89.28,23.29 90.62,24.63 U17#3.2 ; CN1.2 86.53,94.97 v1(82.42,94.97) 78.43,94.97 74.46,98.95 26.13,98.95 NOREF.1 24.64,89.33 24.64,81.84 25.7,80.78 27.57,80.78 U17#4.13 37.82,70.54 41.66,70.54 49.66,62.53 49.66,51.36 45.97,47.68 ; 5.57,35.08 9.81,30.84 9.81,29.73 14.78,24.76 U17.2 ; 5.57,35.08 5.41,34.92 U17.13
A+5V: length 85.9
  Top Layer w0.5: U11.8 90.62,56.82 v2(93.22,56.82) ; 83.55,73.2 84.41,74.06 U5.5
  Top Layer w0.8: C20.1 58.79,64.72 U12.8 ; C9.1 83.55,73.2 NOREF#2.1
  Bottom Layer w0.8: 80.01,62.47 80.01,66.57 R19.3 ; 80.01,62.47 80.71,61.77 85.98,61.77 90.16,57.6 U11.8 ; 80.01,62.47 80.01,60.42 R14.3 77.59,58.01 R29.3 66.7,62.92 59.06,62.92 58.49,63.48 58.49,64.42 U12.8 ; CN15.2 95.88,56.82 v2(93.22,56.82) 93.22,55.55 95.25,53.52 CN4.1 ; R19.3 81.35,68.96 NOREF#2.1 ; R19.3 77.53,69.05 R24.3
ADC1_IN8: length 118.5
  Top Layer w0.3: H9#3.4 28.8,58.47 23.15,64.12 22.15,64.12
  Top Layer w0.305: U20#2.8 81.13,14.86 80.71,15.28 80.71,35.22 82.23,36.75 H9#2.4 ; 22.15,64.12 21.83,64.44 15.17,64.44 14.43,63.7 U20#3.8 ; U20.8 48.11,14.86 47.5,15.47 47.5,33.83 49.21,35.55 H9.4 ; H9#4.4 16.13,42.72 16.13,31.3 14.61,29.77 14.61,15.3 14.91,15 15.63,15
ADC1_IN9: length 107.7
  Top Layer w0.3: H9#3.3 37.78,65.14
  Top Layer w0.305: 37.78,65.14 37.54,65.38 16.97,65.38 16.67,65.69 U21#3.8 ; U21.8 46.37,17.1 46.67,17.41 H9.3 ; U21#2.8 79.39,17.1 79.69,17.41 H9#2.3 ; U21#4.8 13.28,17.24 13.59,17.54 H9#4.3
ADC_IN15: length 12.1
  Top Layer w0.3: CN15.12 97.79,84.51 97.03,83.74 97.03,81.2 95.78,79.96 R40.1 95.07,80.26 C43.2 93.03,80.21 R41.2 91.03,80.06 D2.1
ADC_IN_HALL_1: length 7
  Top Layer w0.5: R22.1 R23.2 90.53,51.97 88.52,49.96 CN11.12
ADC_IN_HALL_2: length 24.5
  Top Layer w0.5: CN11.11 86.23,48.56 87.5,47.3 90.17,47.3 90.93,48.06 90.93,50.6 94.87,54.53 94.87,61.79 94.47,62.19 94.47,62.87 R18.2 R17.1
ADC_IN_HALL_3: length 56.4
  Top Layer w0.5: R32.1 R33.2 56.48,69.23 53.47,66.22 53.47,49.71 56.13,47.04 81.91,47.04 CN11.10
ADC_IN_HALL_4: length 34.2
  Top Layer w0.5: v4(55.8,52.85) 54.8,53.86 R27.1 R28.2
  Bottom Layer w0.5: v4(55.8,52.85) 58.31,50.34 67.56,50.34 68.58,51.36 78.1,51.36 CN11.9
ALT_1_A: length 78.9
  Top Layer w1.5: U17#2.8 36.33,22.09 34.99,20.74 34.99,11.21 CN7.1 ; CN7#2.1 68.01,11.21 68.01,20.74 69.35,22.09 U17#3.8 ; U17.8 3.25,22.22 1.91,20.88 1.91,11.35 CN7#4.1 ; CN7#3.1 10.78,76.82 20.31,76.82 21.66,75.48 U17#4.8
ALT_1_B: length 50.7
  Top Layer w0.35: R43#2.1 73.32,12.72 74.16,13.56 U20#2.3 ; R43.1 40.3,12.72 41.14,13.56 U20.3 ; R43#3.1 12.29,71.51 13.13,70.67 U20#3.3 ; U20#4.3 8.06,13.7 7.22,12.86 R43#4.1
  Top Layer w1.5: CN7.2 44.81,7.1 R43.1 ; R43#3.1 6.66,67 CN7#3.2 ; R43#2.1 77.83,7.1 CN7#2.2 ; CN7#4.2 11.72,7.23 R43#4.1
ALT_1_B_CS: length 59.8
  Top Layer w0.35: R43#3.2 16.38,72.63 13.78,70.03 U20#3.2 ; R43.2 39.18,16.81 41.78,14.21 U20.2 ; R43#2.2 72.2,16.81 74.8,14.21 U20#2.2 ; R43#4.2 6.1,16.95 8.7,14.35 U20#4.2
  Top Layer w1.5: U17#3.9 72.12,24.63 73.47,23.28 73.47,20.13 R43#2.2 ; U17#4.9 24.2,72.71 22.85,71.36 19.69,71.36 R43#3.2 ; U17.9 6.02,24.76 7.37,23.42 7.37,20.26 R43#4.2 ; U17#2.9 39.1,24.63 40.45,23.28 40.45,20.13 R43.2
ALT_2_A: length 199
  Top Layer w1.5: CN7#4.3 19.64,3.61 24,3.61 31.75,11.35 31.75,33.96 28.25,37.47 U17.7 ; CN7#3.3 3.04,59.08 3.04,54.72 10.79,46.98 33.39,46.98 36.9,50.48 U17#4.7 ; CN7.3 52.73,3.47 57.09,3.47 64.83,11.22 64.83,33.82 61.33,37.33 U17#2.7 ; U17#3.7 94.35,37.33 97.85,33.82 97.85,11.22 90.11,3.47 85.75,3.47 CN7#2.3
ALT_2_B: length 74
  Top Layer w0.305: U21#2.3 85.97,18.4 86.42,18.86 88.46,18.86 ; R44#2.1 53.4,18.86 52.95,18.4 U21.3 ; U21#4.3 19.86,18.54 20.32,18.99 R44.1 ; U21#3.3 17.97,58.86 18.42,58.41 R44#4.1
  Top Layer w1.5: v4(25.4,15.8) 22.35,18.85 R44.1 ; R44#4.1 18.28,56.38 v4(15.23,53.33) ; R44#2.1 55.44,18.71 v4(58.48,15.66)
  Bottom Layer w1.5: CN7#3.4 9.64,53.33 v4(15.23,53.33) ; CN7#2.4 91.5,10.07 v4(91.5,15.66) ; v4(58.48,15.66) 58.48,10.07 CN7.4 ; v4(25.4,15.8) 25.4,10.2 CN7#4.4
ALT_2_B_CS: length 148.6
  Top Layer w0.305: 17.32,60.56 17.26,60.5 17.26,59.39 17.05,59.17 14,59.17 12.29,57.46 R44#4.2 ; R44.2 21.27,12.86 19.56,14.57 19.56,17.62 19.34,17.83 18.22,17.83 U21#4.2 ; U21#2.2 84.33,17.69 85.45,17.69 85.66,17.48 85.66,14.43 87.37,12.72 ; R44#2.2 54.35,12.72 52.64,14.43 52.64,17.48 52.43,17.69 51.31,17.69 U21.2
  Top Layer w1.5: 86.87,12.12 92.78,12.12 94.55,13.88 94.55,32.17 91.94,34.79 U17#3.6 ; U17#2.6 58.92,34.79 61.53,32.17 61.53,13.88 60.37,12.72 R44#2.2 ; R44.2 27.29,12.86 28.45,14.02 28.45,32.31 25.83,34.92 U17.6 ; U17#4.6 34.36,52.9 31.74,50.28 13.45,50.28 12.29,51.44 R44#4.2
ENC_A: length 5.6
  Top Layer w0.6: CN17.9 50.87,79.89 CN9.7
ENC_B: length 5.6
  Top Layer w0.6: CN17.8 53.27,85.24 CN9.8
ENC_KEY: length 5.6
  Top Layer w0.6: CN9.6 48.27,85.32 CN17.10
HALL_IN1: length 23.5
  Top Layer w0.5: CN4.3 94.23,46.28 85.85,46.28 84.71,47.42 84.71,50.39 82.42,52.69 ; 82.42,52.69 78.36,48.63 CN11.8 ; 82.42,52.69 R20.1
HALL_IN2: length 51.9
  Top Layer w0.5: R15.1 84.06,69.48 83.25,70.28 76.33,70.28 75.82,69.77 CN11.7
  Bottom Layer w0.5: CN11.7 79.12,45.26 94.78,45.26 CN4.4
HALL_IN3: length 54.6
  Top Layer w0.5: R30.1 67.75,69.23 69.06,70.54 72.26,70.54 73.91,68.89 73.91,49.2 CN11.6
  Bottom Layer w0.5: CN4.5 93.3,44.25 75.69,44.25 73.28,46.66 CN11.6
HALL_IN4: length 8.2
  Top Layer w0.5: CN11.5 70.48,48.56 66.33,52.72 64.21,52.72
I2C2_SCL: length 4.4
  Top Layer w0.5: CN3.4 62.82,83.59 CN17.5
I2C2_SDA: length 3.8
  Top Layer w0.5: CN17.4 63.82,85.13 CN3.3
NRST: length 60.1
  Top Layer w0.3: SW1.1 32.79,88.27 30.99,90.08 30.99,94.93 37.46,94.93 38.09,95.55 H8.1
  Top Layer w0.6: 56.39,91.52 56.39,91.11 v2(56.47,91.02) R37#4.2 55.13,89.41 SW1#4.1 ; SW1.1 34.21,89.63 R37.2 C40#4.2 ; SW1#3.1 47.89,89.54 R37#3.2 C40#2.2 ; C40.2 R37#2.2 40.91,89.54 SW1#2.1
  Bottom Layer w0.3: v2(42.54,91.24) 42.54,94.79 H8.2 ; H8.3 44.32,95.47 v2(48.84,90.95) ; v2(56.47,91.02) 51.94,95.55 H8.4
OLED_SCL: length 15.7
  Top Layer w0.6: CN17.12 43.27,85.36 CN9.4 47.36,75.7 H8#2.3 47.44,73.97 R6.1
OLED_SDA: length 15.8
  Top Layer w0.6: CN17.11 45.79,79.81 CN9.5 49.9,75.66 H8#2.4 50.09,73.86 R7.1
PB14: length 61.1
  Top Layer w0.3: H9#3.5 34.04,55.93 33.78,56.19 32.23,56.19 29.28,53.23 ; H9#2.5 84.77,36.53 U17#3.4 ; H9.5 51.75,36.53 U17#2.4 ; H9#4.5 19.81,41.58 19.81,35.53 U17.4
PB15: length 74.1
  Top Layer w0.3: H9#3.2 38.73,66.73 33.15,66.73 26.74,73.14 U17#4.10
  Top Layer w0.305: H9#4.2 11.05,33.62 U17.10 ; U17#3.10 77.15,33.48 H9#2.2 ; H9.2 44.13,33.48 U17#2.10
PC7: length 47.9
  Top Layer w0.3: U17#3.5 87.31,36.53 H9#2.6 ; H9#4.6 21.21,36.67 U17.5 ; H9.6 54.29,36.53 U17#2.5 ; H9#3.6 40.26,55.04 33.62,55.04 U17#4.5
PC8: length 59.7
  Top Layer w0.3: 33.05,70.22 34.51,68.76 39.24,68.76 H9#3.1
  Top Layer w0.305: H9#4.1 8.51,33.62 U17.11 ; U17#3.11 75.18,34.06 75.18,42.02 H9#2.1 ; 33.05,70.22 29.28,73.99 ; U17#2.11 41.59,33.48 H9.1
PD0: length 10.8
  Top Layer w0.3: R35#2.1 67.79,95.84 H8#3.3 ; R35#3.1 71.22,94.95 H8#3.4 ; H8#3.1 61.85,95.34 60.96,94.45 R35#4.1 ; R35.1 H8#3.2
PD8: length 5.4
  Top Layer w0.5: CN3.5 61.82,82.63 60.45,84 59.87,84 CN17.6
PD9: length 6.7
  Top Layer w0.5: CN3.6 60.82,82.15 60.02,82.95 58.38,82.95 CN17.7
TPS_EN: length 9.9
  Top Layer w0.6: R2.2 6.09,88.56 ; U3.5 9.78,87.69 10.16,88.06 10.16,89.33 9.74,89.76 6.98,89.76 6.09,88.86 R1.1
TPS_SW: length 9.3
  Top Layer w0.6: L1.1 12.5,87.17 11.98,87.69 U3.2
  Top Layer w1: C5.1 12.43,82.4 L1.1
$1N1133: length 3.1
  Top Layer w0.6: U3.6 9.41,86.35 C5.2
$1N1138: length 4.1
  Top Layer w0.6: C8.2 5.03,82.02 R4.2 4.95,81.94 R3.1
$1N7509: length 2.1
  Top Layer w0.5: C10.2 80.94,75.26 U5.4
$1N7699: length 2.2
  Top Layer w0.5: U6.4 89.75,75.65 C12.2
$1N22323: length 8.1
  Top Layer w0.5: U11.3 83.52,66.46 R19.2
$1N22620: length 7.3
  Top Layer w0.5: C18.2 89.66,67.46 R16.2 89.64,65.42 U11.1 R17.2
$1N22630: length 6.6
  Top Layer w0.5: R15.2 86.47,69.48 C18.1 88.26,67.57 R16.1 88.13,65.42 U11.2
$1N29992: length 5.6
  Top Layer w0.5: R14.2 80.79,55.54 U11.5
$1N30121: length 6.5
  Top Layer w0.5: R20.2 85.65,52.71 C19.1 85.65,54.68 R21.1 85.59,56.77 U11.6
$1N30128: length 6.7
  Top Layer w0.5: R21.2 87.05,54.7 C19.2 ; R21.2 R22.2 ; R21.2 87.1,56.77 U11.7
$1N30459: length 8.4
  Top Layer w0.5: U12.3 65.59,55.51 R29.2
$1N30463: length 7.3
  Top Layer w0.5: R27.2 58.73,57.03 U12.1 59.37,56.65 R26.2 59.37,52.78 C21.2
$1N30464: length 6.6
  Top Layer w0.5: R25.2 C21.1 60.88,52.76 R26.1 61.39,55.14 U12.2
$1N30664: length 5.9
  Top Layer w0.5: U12.5 69.84,64.78 R24.2
$1N30669: length 6.7
  Top Layer w0.5: R30.2 C22.1 63.41,69.17 R31.1 63.41,65.3 U12.6
$1N30675: length 6.6
  Top Layer w0.5: U12.7 61.91,65.3 R31.2 ; C22.2 61.95,67.37 R31.2 ; R31.2 R32.2
$1N32047: length 2.6
  Top Layer w0.5: C24.2 73.11,75.49 74.91,75.49 U13.4
$1N44282: length 8.9
  Top Layer w0.6: R35.2 64.41,92.88 64.41,90.68 ; 60.95,90.72 60.95,92.92 R35#4.2 ; R35#2.2 67.8,92.8 LED2#2.1 ; R35#3.2 71.23,92.8 LED2#3.1
$1N45688: length 10.8
  Top Layer w0.6: R5.2 7.25,81.19 R4.1 6.48,83.95 C8.1 6.73,83.99 7.75,85.01 7.75,88.05 8.37,88.68 9.07,88.68 9.08,88.69
$1N85378: length 4.2
  Top Layer w0.3: 94.99,77.01 95.76,77.01 CN15.10
  vias: v4(94.49,77.01)
